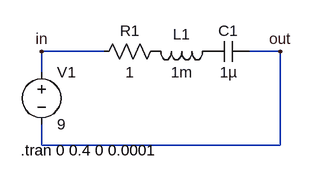
[diagram p0: schematic Draft1.asc]
Draft1.asc, the LTspice schematic file:
Version 4.1
SHEET 1 880 680
WIRE 32 128 -64 128
WIRE 304 128 256 128
WIRE -64 160 -64 128
WIRE -64 272 -64 240
WIRE 304 272 304 128
WIRE 304 272 -64 272
FLAG -64 128 in
FLAG 304 128 out
SYMBOL cap 256 112 R90
WINDOW 0 0 32 VBottom 2
WINDOW 3 32 32 VTop 2
SYMATTR InstName C1
SYMATTR Value 1µ
SYMBOL ind 208 112 R90
WINDOW 0 5 56 VBottom 2
WINDOW 3 32 56 VTop 2
SYMATTR InstName L1
SYMATTR Value 1m
SYMATTR SpiceLine Rser=1m
SYMBOL res 128 112 R90
WINDOW 0 0 56 VBottom 2
WINDOW 3 32 56 VTop 2
SYMATTR InstName R1
SYMATTR Value 1
SYMBOL voltage -64 144 R0
SYMATTR InstName V1
SYMATTR Value 9
TEXT -96 280 Left 2 !.tran 0 0.4 0 0.0001

The netlist it stands for:
* Draft1.asc
C1 out P001 1µ
L1 P001 P002 1m Rser=1m
R1 P002 in 1
V1 in out 9
.tran 0 0.4 0 0.0001
.backanno
.end